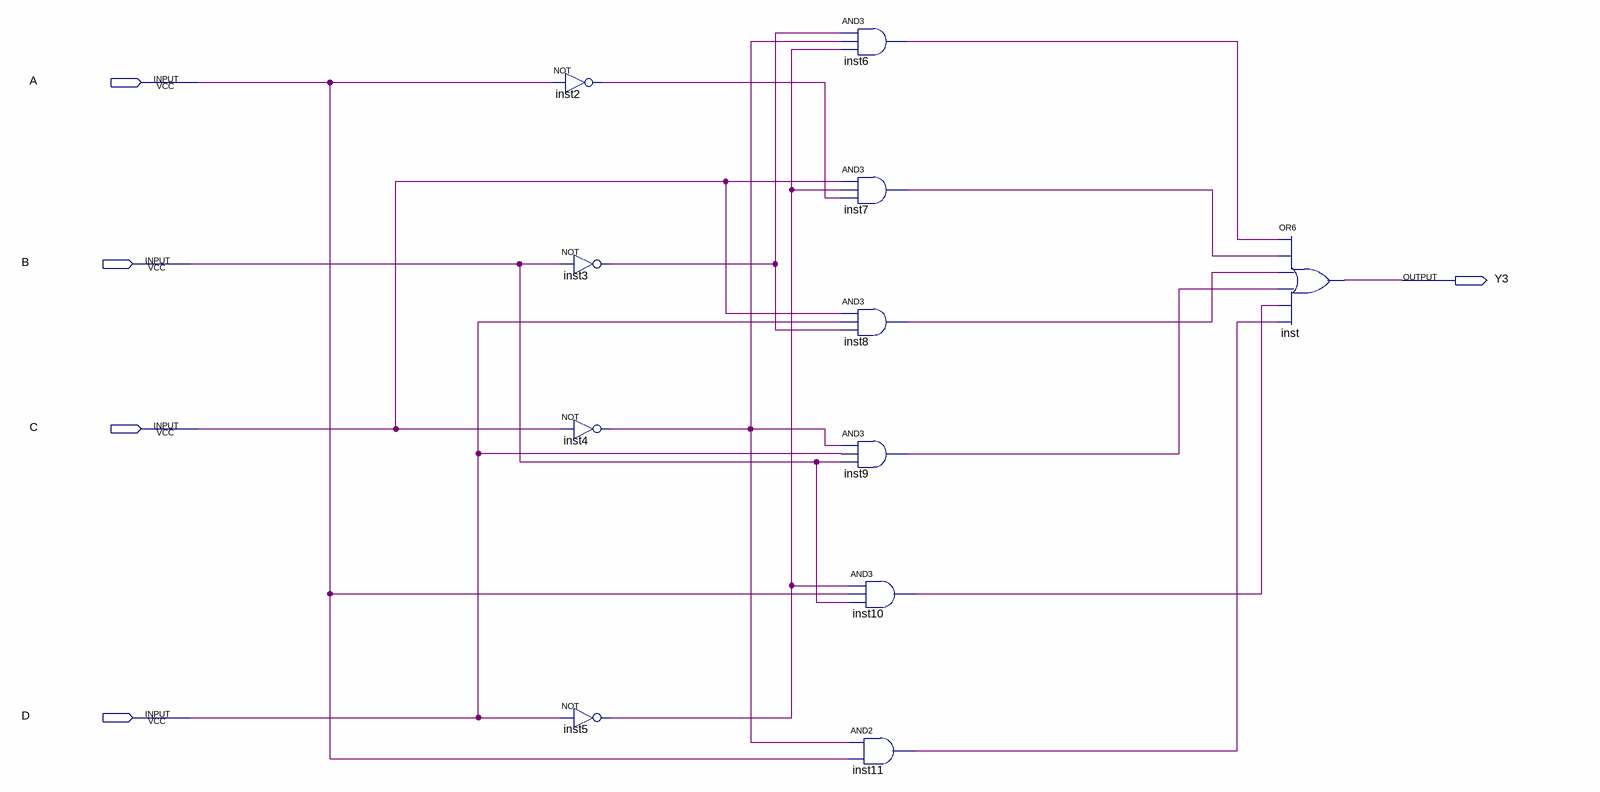
[diagram p0: schematic sheet]
// Quartus schematic three.bdf as structural Verilog: 11 symbols, 5 pins
module three (
  input  A,
  input  B,
  input  C,
  input  D,
  output Y3
);

  wire inst2_out, inst3_out, inst4_out, inst5_out, inst6_out, inst7_out, inst8_out, inst9_out, inst10_out,
       inst11_out;

  not inst2 (inst2_out, A);
  not inst3 (inst3_out, B);
  not inst4 (inst4_out, C);
  not inst5 (inst5_out, D);
  and inst6 (inst6_out, inst3_out, inst4_out, inst5_out);
  and inst7 (inst7_out, C, inst5_out, inst2_out);
  and inst8 (inst8_out, C, D, inst3_out);
  and inst9 (inst9_out, inst4_out, D, B);
  and inst10 (inst10_out, inst5_out, A, B);
  and inst11 (inst11_out, inst4_out, A);
  or inst (Y3, inst6_out, inst7_out, inst8_out, inst9_out, inst10_out, inst11_out);
endmodule
